# Altium schematic sheet CAp_STM.SchDoc
size A3; Author: Audran; CompanyName: Goldorak; Address1: Electrolab; Address2: 52 rue Paul Lescop; Address3: 92000 Nanterre; ProjectName: Cartes_2017
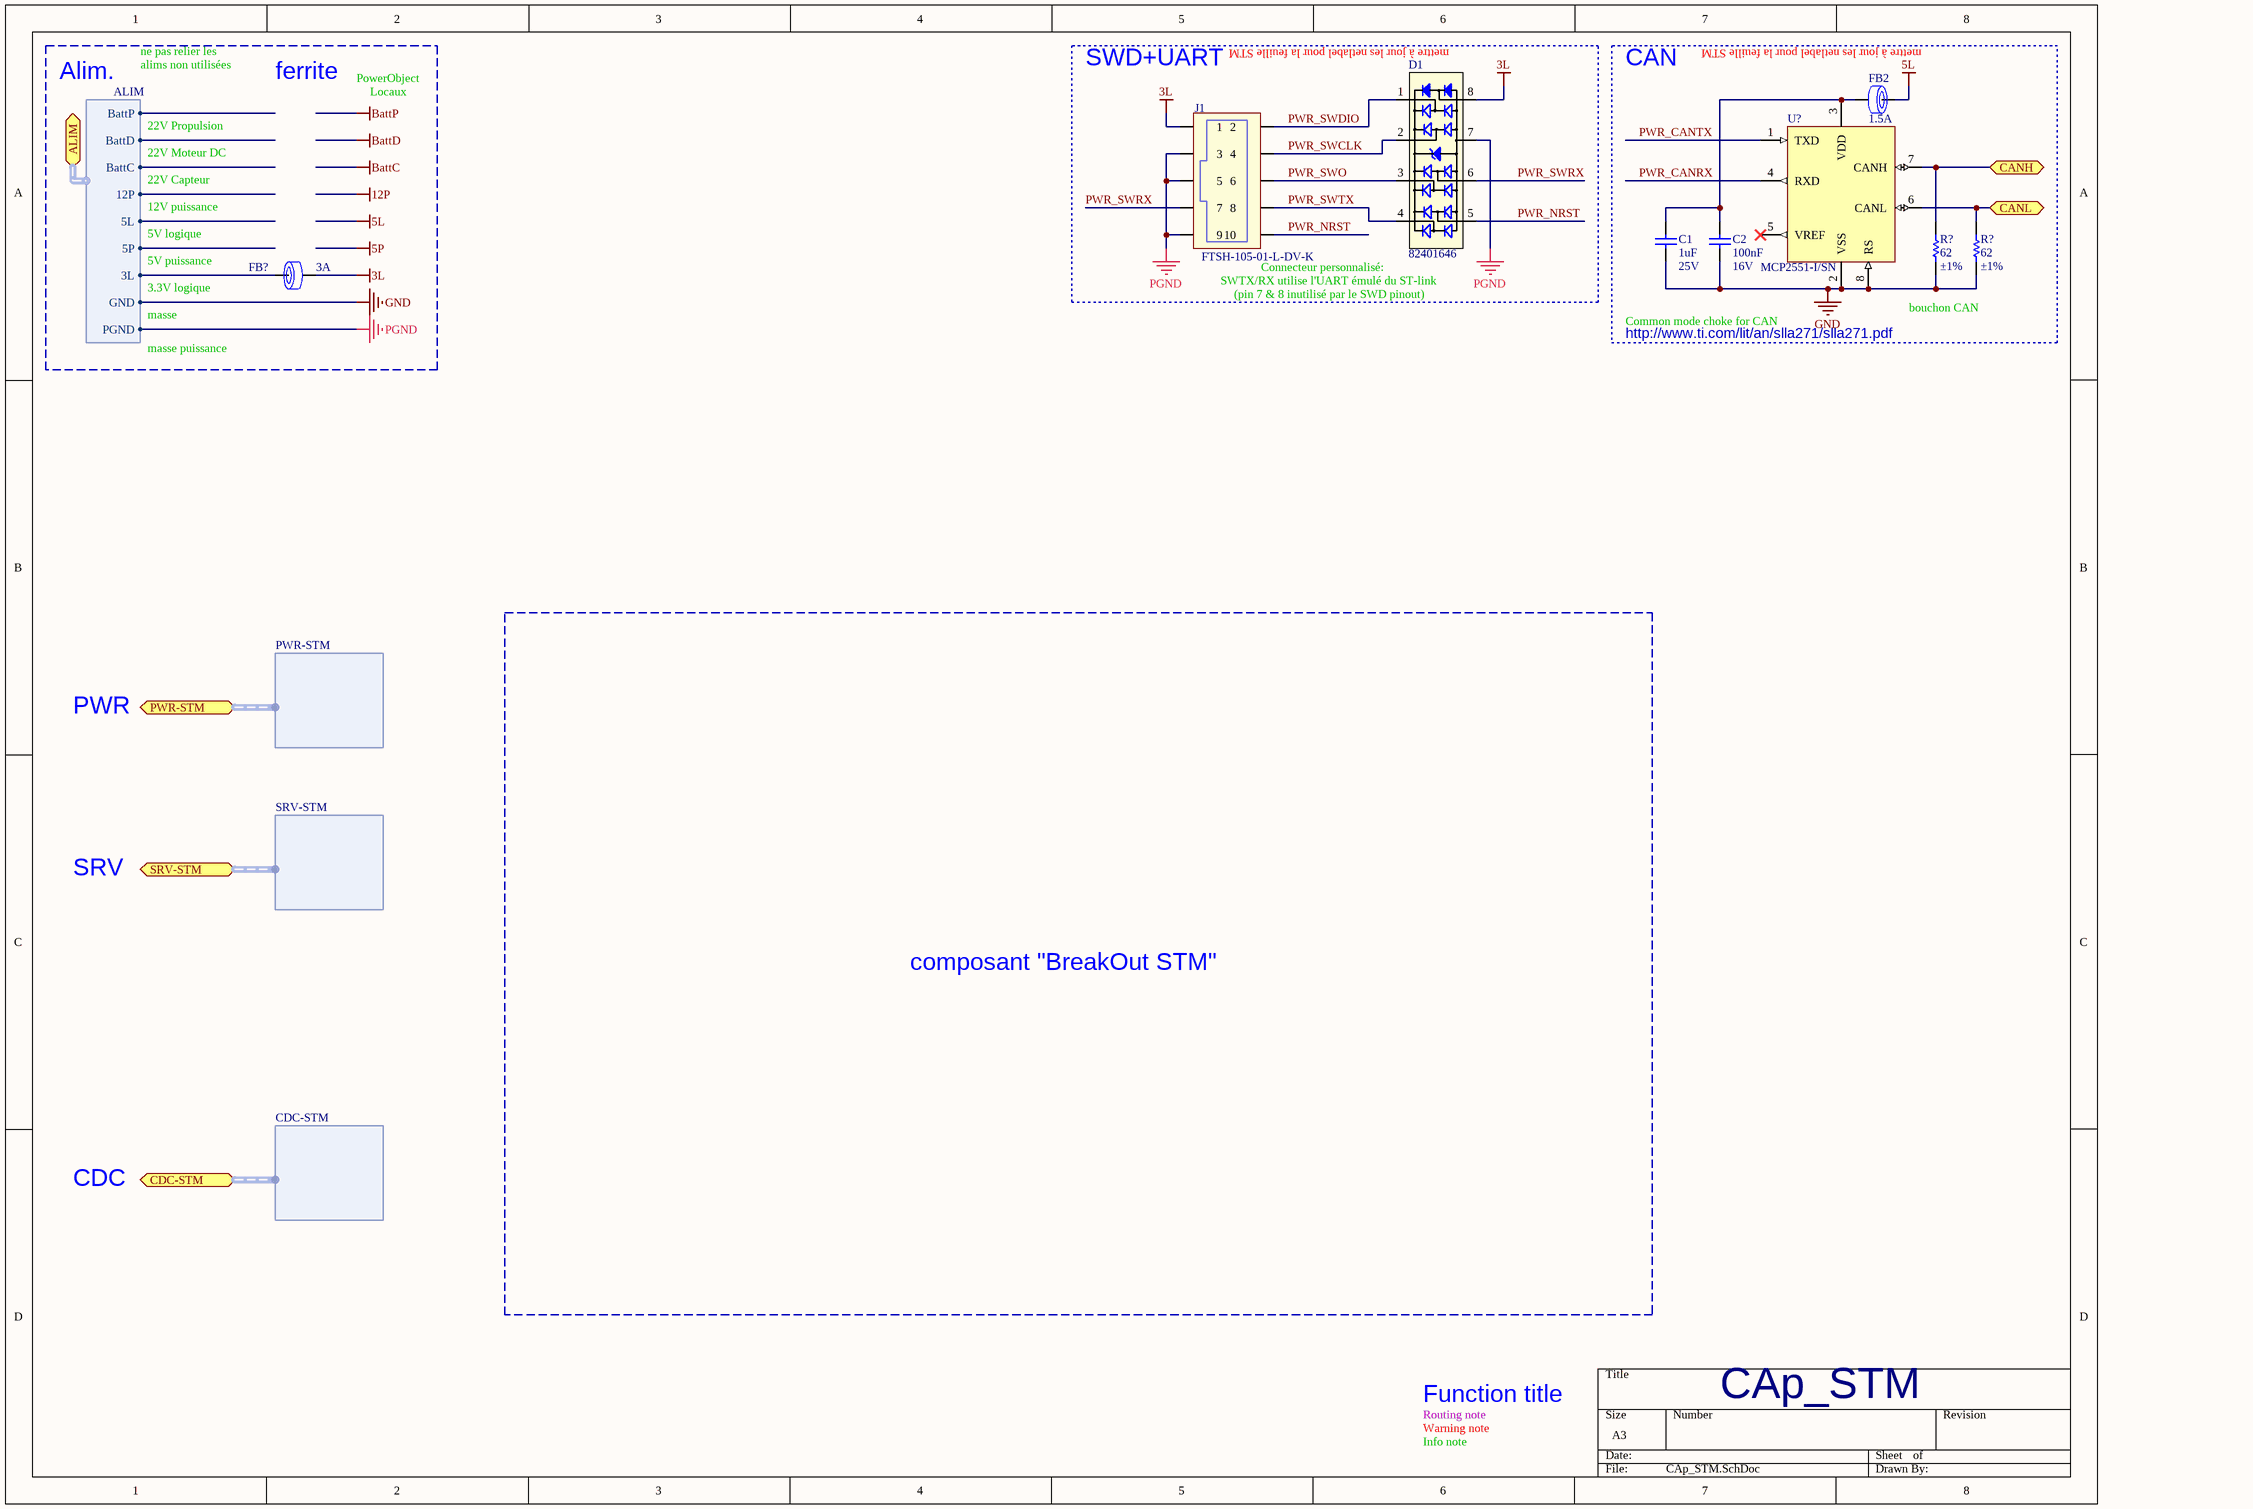
[diagram p0: CAp_STM.SchDoc]

## Parts
(Parts that share a designator on the sheet are numbered #1, #2 ... from top to bottom, then left to right.)
C1  1uF  RatedVoltage: 25V  [WCAP-CSGP_0603, 1.6x0.8x0.8]
C2  100nF  RatedVoltage: 16V  [WCAP-CSGP_0402, 1x0.5x0.5]
D1  82401646  [MSOP-8L]
FB2  RatedCurrent: 1.5A  [WE-CBF_0603_High Current]  (hidden comment: 742792624)
FB?  RatedCurrent: 3A  [WE-CBF_0805_High Current]  (hidden comment: 742792023)
J1  FTSH-105-01-L-DV-K  [FTSH-105-01-L-DV-K]
R?#1  value 62  Precision: ±1%  [RESC1005X04N]  (hidden comment: RC0402FR-0762RL)
R?#2  value 62  Precision: ±1%  [RESC1005X04N]  (hidden comment: RC0402FR-0762RL)
U?  MCP2551-I/SN  [SO8_N]

## Blocks framed on the sheet
SWD+UART: D1 J1
CAN: C1 C2 FB2 R?#1 R?#2 U?

## Ports
ALIM (harness ALIM), CANH, CANL, CDC-STM (harness CDC-STM), PWR-STM (harness PWR-STM), SRV-STM (harness SRV-STM)

## Harnesses
PWR-STM: 
SRV-STM: 
CDC-STM: 
ALIM: BattP, BattD, BattC, 12P, 5L, 5P, 3L, GND, PGND

## Nets
3L: D1.8 FB?.2 J1.1
5L: FB2.1
GND: C1.1 C2.1 R?#1.1 R?#2.1 U?.2(VSS) U?.8(RS) ; port ALIM.GND
PGND: D1.7 J1.3 J1.5 J1.9 ; port ALIM.PGND
CANH: R?#1.2 U?.7(CANH) ; port CANH
CANL: R?#2.2 U?.6(CANL) ; port CANL
PWR_CANRX: U?.4(RXD)
PWR_CANTX: U?.1(TXD)
PWR_NRST: D1.5 J1.10
PWR_SWCLK: D1.2 J1.4
PWR_SWDIO: D1.1 J1.2
PWR_SWO: D1.3 J1.6
PWR_SWRX: D1.6 J1.7
PWR_SWTX: D1.4 J1.8
NetC1_2: C1.2 C2.2 FB2.2 U?.3(VDD)
NetFB?_1: FB?.1 ; port ALIM.3L

Not connected (* = marked no-connect by the designer): U? 5(VREF)*

## Notes on the sheet
- (near D1) mettre à jour les netlabel pour la feuille STM
- (near FB2) mettre à jour les netlabel pour la feuille STM
- Alim.
- ne pas relier les
- alims non utilisées
- ferrite
- PowerObject
- Locaux
- 22V Propulsion
- 22V Moteur DC
- 22V Capteur
- 5V logique
- 12V puissance
- 5V puissance
- 3.3V logique
- masse
- SWTX/RX utilise l'UART émulé du ST-link
- (pin 7 & 8 inutilisé par le SWD pinout)
- Connecteur personnalisé:
- (near R?#1) bouchon CAN
- masse puissance
- http://www.ti.com/lit/an/slla271/slla271.pdf
- Common mode choke for CAN
- PWR
- SRV
- composant "BreakOut STM"
- CDC
- Routing note
- Warning note
- Info note
- Function title
- CAp_STM

## Library data of the parts
C1 = WCAP-CSGP, 885012206076: CAP CER 1uF 25V X7R 0603; Manufacturer: Wurth Elektronik; PublishedDate: Aug 2016; ComponentLink1Description: Manufacturer; ComponentLink1URL: http://www.we-online.de; ComponentLink2Description: Datasheet; ComponentLink2URL: http://katalog.we-online.com/pbs/datasheet/885012206076.pdf; Manufacturer Part Number: 885012206076; Value: 1uF; Size: 0603; CeramicType: X7R
C2 = WCAP-CSGP, 885012205037: CAP CER 100nF 16V X7R 0402; Manufacturer: Wurth Elektronik; PublishedDate: Aug 2016; ComponentLink1Description: Manufacturer; ComponentLink1URL: http://www.we-online.de; ComponentLink2Description: Datasheet; ComponentLink2URL: http://katalog.we-online.com/pbs/datasheet/885012205037.pdf; Value: 100nF; Size: 0402; CeramicType: X7R; Manufacturer Part Number: 885012205037
D1 = 82401646: TVS DIODE 5VWM 13VC 8MSOP; Manufacturer: Wurth Electronics Inc.; Supplier 1: Farnell; Manufacturer Part Number: 82401646; ComponentLink1URL: http://katalog.we-online.de/pbs/datasheet/82401646.pdf; ComponentLink1Description: Datasheet; Supplier Part Number 1: 1825864
FB2 = WE-CBF, 742792624: Ferrite Bead 180ohm 0603 max1.5A; Manufacturer: Wurth Elektronik; Value: 180Ω; Type: High Current; PublishedDate: Aug 2016; ComponentLink1Description: Manufacturer; ComponentLink1URL: http://www.we-online.de; ComponentLink2Description: Datasheet; ComponentLink2URL: http://katalog.we-online.de/pbs/datasheet/742792624.pdf; Manufacturer Part Number: 742792624; Size: 0603
FB? = WE-CBF, 742792023: Ferrite Bead 120ohm 0805 max3.0A; Manufacturer: Wurth Elektronik; Value: 120Ω; Type: High Current; PublishedDate: Aug 2016; ComponentLink1Description: Manufacturer; ComponentLink1URL: http://www.we-online.de; ComponentLink2Description: Datasheet; ComponentLink2URL: http://katalog.we-online.de/pbs/datasheet/742792023.pdf; Manufacturer Part Number: 742792023; Size: 0805
J1 = FTSH-105-01-L-DV-K: CONN HEADER 10 POS DUAL .05" SMD with Keying; Manufacturer: Samtec Inc.; Supplier 1: Digi-Key; Manufacturer Part Number: FTSH-105-01-L-DV-K; ComponentLink1URL: http://suddendocs.samtec.com/prints/ftsh-1xx-xx-xxx-dv-xxx-xxx-mkt.pdf; ComponentLink1Description: Datasheet; Supplier Part Number 1: SAM8799-ND
R?#1 R?#2 = RC0402FR-0762RL: RES SMD 62 OHM 1% 1/16W 0402; Manufacturer: Yageo; Power: 63mW; Vmax: 50V; Type: Thick Film; ComponentLink1Description: Manufacturer; ComponentLink1URL: http://www.yageo.com/NewPortal/_en/index.jsp; ComponentLink2Description: Datasheet; ComponentLink2URL: http://www.farnell.com/datasheets/2167052.pdf; Manufacturer Part Number: RC0402FR-0762RL; Supplier 1: Farnell; Supplier Part Number 1: 1458813
U? = MCP2551-I/SN: IC TRANSCEIVER CAN HI-SPD 8-SOIC; Manufacturer: Microchip Technology; Manufacturer Part Number: MCP2551-I/SN; ComponentLink1Description: Datasheet; ComponentLink1URL: http://www.farnell.com/datasheets/657417.pdf; Supplier 1: Farnell; Supplier Part Number 1: 9758569